# Altium schematic sheet Power Inputs.SchDoc
size A; SheetNumber: 3; SheetTotal: 4
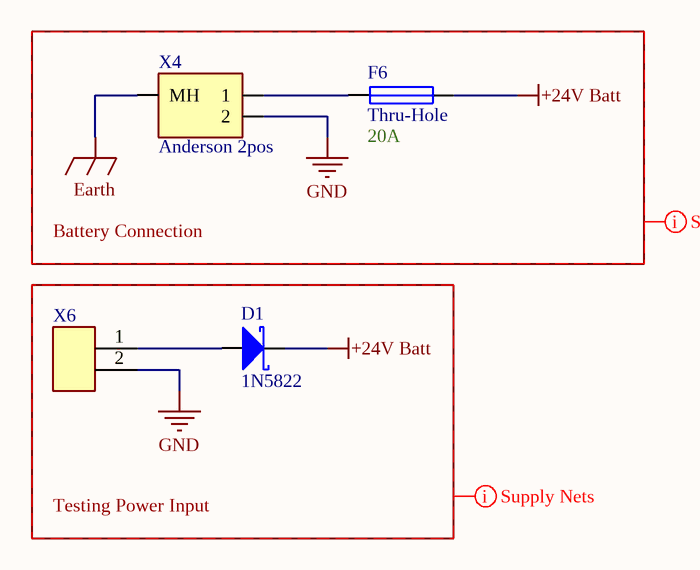
[diagram p0: Power Inputs.SchDoc]

## Parts
D1  1N5822  [[Diode] Thru-Hole Schottky]
F6  Thru-Hole  Capacity: 20A  [[Fuse] Thru-Hole Blade]
X4  Anderson 2pos  [[Anderson] 2pos Right-Angle 1327G17]
X6  2pin Screw Terminal  [[Screw Terminal] 2pin 5mm]  (value not drawn)

## Blocks framed on the sheet
Battery Connection: F6 X4
Testing Power Input: D1 X6

## Nets
+24V Batt: D1.1(K) F6.2
Earth: X4.MH
GND: X4.2 X6.2
NetD1_2: D1.2(A) X6.1
NetF6_1: F6.1 X4.1

## Layout directives
net class Supply_Nets: +24V Batt, Earth, GND

## Library data of the parts
D1 = [Diode] Thru-Hole Schottky: Mouser Part #: 511-1N5822; Supplier 1: DigiKey; Supplier Part Number 1: 1N5822GOS-ND
F6 = [Fuse] Thru-Hole Blade: Mouser Part #: *; Supplier 1: DigiKey; Supplier Part Number 1: WK6265-ND
X4 = [Anderson] 2pos Right-Angle 1327G17
X6 = [Screw Terminal] 2pin: Supplier 1: DigiKey; Supplier Part Number 1: 102-6145-ND